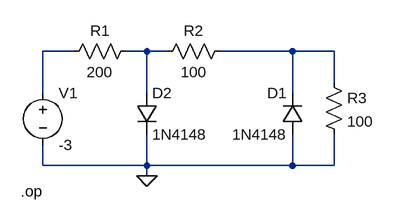
[diagram p0: schematic 3_-3V.asc]
3_-3V.asc, the LTspice schematic file:
Version 4
SHEET 1 880 680
WIRE 64 80 16 80
WIRE 176 80 144 80
WIRE 208 80 176 80
WIRE 400 80 288 80
WIRE 464 80 400 80
WIRE 464 128 464 80
WIRE 16 144 16 80
WIRE 176 144 176 80
WIRE 400 144 400 80
WIRE 16 256 16 224
WIRE 176 256 176 208
WIRE 176 256 16 256
WIRE 400 256 400 208
WIRE 400 256 176 256
WIRE 464 256 464 208
WIRE 464 256 400 256
WIRE 176 272 176 256
FLAG 176 272 0
SYMBOL voltage 16 128 R0
WINDOW 123 0 0 Left 2
WINDOW 39 0 0 Left 2
SYMATTR InstName V1
SYMATTR Value -3
SYMBOL res 160 64 R90
WINDOW 0 0 56 VBottom 2
WINDOW 3 32 56 VTop 2
SYMATTR InstName R1
SYMATTR Value 200
SYMBOL res 304 64 R90
WINDOW 0 0 56 VBottom 2
WINDOW 3 32 56 VTop 2
SYMATTR InstName R2
SYMATTR Value 100
SYMBOL diode 416 208 R180
WINDOW 0 24 64 Left 2
WINDOW 3 24 0 Left 2
SYMATTR InstName D1
SYMATTR Value 1N4148
SYMBOL diode 160 144 R0
SYMATTR InstName D2
SYMATTR Value 1N4148
SYMBOL res 448 112 R0
SYMATTR InstName R3
SYMATTR Value 100
TEXT -18 296 Left 2 !.op

The netlist it stands for:
* 3_-3V.asc
V1 N001 0 -3
R1 N002 N001 200
R2 N003 N002 100
D1 0 N003 1N4148
D2 N002 0 1N4148
R3 N003 0 100
.model D D
.lib standard.dio
.op
.backanno
.end